# Altium schematic sheet Sheet1.SchDoc
size A; SheetNumber: 1; SheetTotal: 1
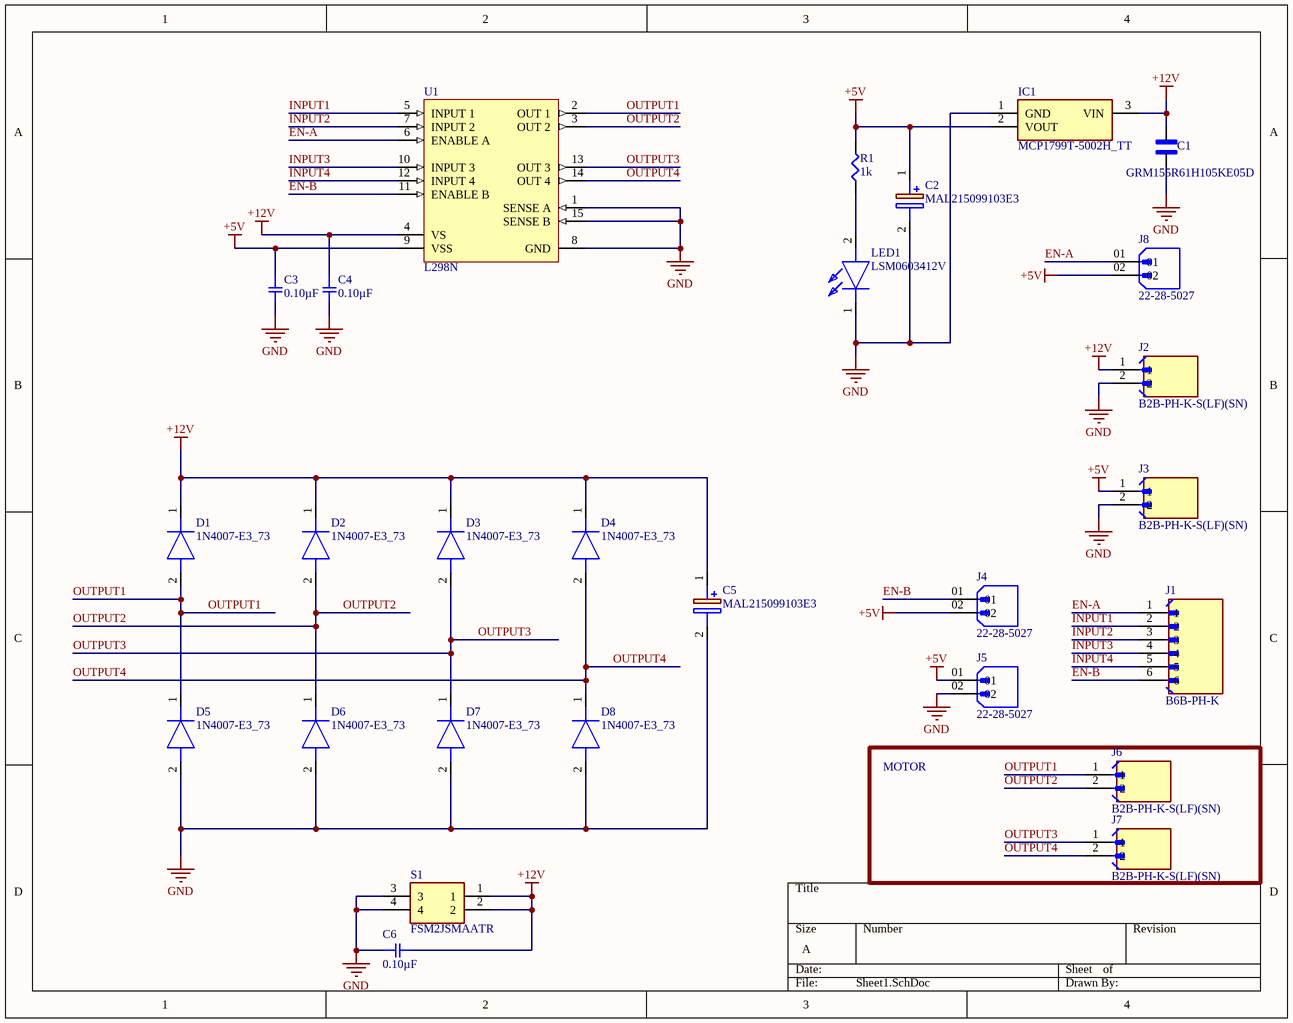
[diagram p0: Sheet1.SchDoc]

## Parts
C1  GRM155R61H105KE05D  [CAPC1005X60N]
C2  MAL215099103E3  [CAPAE1050X1250N]
C3  0.10µF  [SMD-0402C]
C4  0.10µF  [SMD-0402C]
C5  MAL215099103E3  [CAPAE1050X1250N]
C6  0.10µF  [SMD-0402C]
D1  1N4007-E3_73  [PCBComponent_1]
D2  1N4007-E3_73  [PCBComponent_1]
D3  1N4007-E3_73  [PCBComponent_1]
D4  1N4007-E3_73  [PCBComponent_1]
D5  1N4007-E3_73  [PCBComponent_1]
D6  1N4007-E3_73  [PCBComponent_1]
D7  1N4007-E3_73  [PCBComponent_1]
D8  1N4007-E3_73  [PCBComponent_1]
IC1  MCP1799T-5002H_TT  [SOT95P237X112-3N]
J1  B6B-PH-K  [JST_B6B-PH-K]
J2  B2B-PH-K-S(LF)(SN)  [JST_B2B-PH-K-S(LF)(SN)]
J3  B2B-PH-K-S(LF)(SN)  [JST_B2B-PH-K-S(LF)(SN)]
J4  22-28-5027  [MOLEX_22-28-5027]
J5  22-28-5027  [MOLEX_22-28-5027]
J6  B2B-PH-K-S(LF)(SN)  [JST_B2B-PH-K-S(LF)(SN)]
J7  B2B-PH-K-S(LF)(SN)  [JST_B2B-PH-K-S(LF)(SN)]
J8  22-28-5027  [MOLEX_22-28-5027]
LED1  LSM0603412V  [LSM0603412V]
R1  1k  [SMD-0402-RES]
S1  FSM2JSMAATR  [FSM2J_1]
U1  L298N  [STM-FM-15]

## Blocks framed on the sheet
MOTOR: J6 J7

## Nets
+5V: C2.1(+) C3.1 IC1.2(VOUT) J3.1 J4.02 J5.01 J8.02 R1.2 U1.9(VSS)
+12V: C1.2 C4.1 C5.1(+) C6.2 D1.1(K) D2.1(K) D3.1(K) D4.1(K) IC1.3(VIN) J2.1 S1.1 S1.2 U1.4(VS)
GND: C1.1 C2.2(-) C3.2 C4.2 C5.2(-) C6.1 D5.2(A) D6.2(A) D7.2(A) D8.2(A) IC1.1(GND) J2.2 J3.2 J5.02 LED1.1(K) S1.3 S1.4 U1.1(SENSE_A) U1.8(GND) U1.15(SENSE_B)
EN-A: J1.1 J8.01 U1.6(ENABLE_A)
EN-B: J1.6 J4.01 U1.11(ENABLE_B)
INPUT1: J1.2 U1.5(INPUT_1)
INPUT2: J1.3 U1.7(INPUT_2)
INPUT3: J1.4 U1.10(INPUT_3)
INPUT4: J1.5 U1.12(INPUT_4)
OUTPUT1: D1.2(A) D5.1(K) J6.1 U1.2(OUT_1)
OUTPUT2: D2.2(A) D6.1(K) J6.2 U1.3(OUT_2)
OUTPUT3: D3.2(A) D7.1(K) J7.1 U1.13(OUT_3)
OUTPUT4: D4.2(A) D8.1(K) J7.2 U1.14(OUT_4)
NetLED1_2: LED1.2(A) R1.1

## Library data of the parts
C1 = GRM155R61H105KE05D: Capacitor Ceramic Multilayer (MLCC); MF: {'manufacturer': u'Murata'}; Package: None; Price: None; Value: *; MP: GRM155R61H105KE05D; Availability: Unavailable
C2 C5 = MAL215099103E3: Capacitor Polarised; Manufacturer_Name: Vishay; Datasheet Link: https://rs.componentsearchengine.com/Datasheets/1/MAL215099103E3.pdf; Height: 12.5mm; Manufacturer_Part_Number: MAL215099103E3; Mouser Part Number: 594-MAL215099103E3; Mouser Price/Stock: https://www.mouser.co.uk/ProductDetail/Vishay-BC-Components/MAL215099103E3?qs=9y2YoPkPyvaNNuuD%252BAyF3g%3D%3D; Arrow Part Number: MAL215099103E3; Arrow Price/Stock: https://www.arrow.com/en/products/mal215099103e3/vishay?region=nac
C3 C4 C6 = GRM155R61H104KE14D: CAP CER 0.1UF 50V X5R 0402; Manufacturer: Murata Electronics North America; Factory Stock: 0; Unit Price (USD): 0.1; Minimum Quantity: 1; Tolerance: ±10%; Datasheets: http://www.murata.com/~/media/webrenewal/support/library/catalog/products/capacitor/mlcc/c02e.pdf; Image: //media.digikey.com/Renders/Murata%20Renders/ZRB-SERIES-0402.jpg; Digi-Key Part Number: 490-10697-1-ND; Part Number: GRM155R61H104KE14D; Quantity Available: 329219; @ qty: 0; Packaging: Cut Tape (CT); Series: GRM; Part Status: Active; Value: 0.10µF; Voltage: 50V; Temperature Coefficient: X5R; Operating Temperature: -55°C ~ 85°C; Features: -; Ratings: -; Applications: General Purpose; Mounting Type: Surface Mount, MLCC; Package / Case: 0402 (1005 Metric); Size / Dimension: 0.039" L x 0.020" W (1.00mm x 0.50mm); Height - Seated (Max): -; Thickness (Max): 0.022" (0.55mm); Lead Spacing: -; Lead Style: -
D1-D8 = 1N4007-E3_73: Diode; Manufacturer_Name: Vishay; Manufacturer_Part_Number: 1N4007-E3/73; Datasheet Link: https://mouser.componentsearchengine.com/Datasheets/2/1N4007-E3_73.pdf; Mouser Part Number: 625-1N4007-E3/73; Mouser Price/Stock: https://www.mouser.co.uk/ProductDetail/Vishay-General-Semiconductor/1N4007-E3-73?qs=N4vtoAxH%2FSqT3Ng3e4K0Gw%3D%3D; Arrow Part Number: 1N4007-E3/73; Arrow Price/Stock: https://www.arrow.com/en/products/1n4007-e373/vishay?region=europe
IC1 = MCP1799T-5002H_TT: Integrated Circuit; Manufacturer_Name: Microchip; Manufacturer_Part_Number: MCP1799T-5002H/TT; Datasheet Link: https://eu.mouser.com/datasheet/2/268/MCP1799-Data-Sheet-20006248A-1658571.pdf; Height: 1.12mm; Mouser Part Number: 579-CP1799T-5002H/TT; Mouser Price/Stock: https://www.mouser.co.uk/ProductDetail/Microchip-Technology/MCP1799T-5002H-TT?qs=BJlw7L4Cy7%2Fnzou%252BAWMPCQ%3D%3D; Arrow Part Number: MCP1799T-5002H/TT; Arrow Price/Stock: https://www.arrow.com/en/products/mcp1799t-5002htt/microchip-technology?region=nac
J1 = B6B-PH-K: MF: {'manufacturer': u'JST Corporation'}; Package: None; Price: None; Value: *; MP: B6B-PH-K; Availability: Unavailable
J2 J3 J6 J7 = B2B-PH-K-S(LF)(SN): MF: {'manufacturer': u'JST'}; Package: None; Price: None; Value: *; MP: B2B-PH-K-S(LF)(SN); Availability: Unavailable
J4 J5 J8 = 22-28-5027: MF: {'manufacturer': u'Molex'}; Package: None; Price: None; Value: *; MP: 22-28-5027; Availability: Unavailable
LED1 = LSM0603412V: LED; Manufacturer_Name: Visual Communications Company; Datasheet Link: https://vcclite.com/wp-content/uploads/wpallimport/files/files/LSM0603412V.pdf; Height: 0.65mm; Manufacturer_Part_Number: LSM0603412V; Mouser Part Number: 593-LSM0603412V; Mouser Price/Stock: https://www.mouser.co.uk/ProductDetail/VCC/LSM0603412V?qs=%252BEew9%252B0nqrCIKpXilSWEhA%3D%3D; Arrow Part Number: LSM0603412V; Arrow Price/Stock: https://www.arrow.com/en/products/lsm0603412v/visual-communications?region=nac
R1 = ERJ-2GEJ102X: RES SMD 1K OHM 5% 1/10W 0402; Manufacturer: Panasonic Electronic Components; Factory Stock: 0; Unit Price (USD): 0.00350; @ qty: 1500; Minimum Quantity: 1; Power (Watts): 0.1W, 1/10W; Temperature Coefficient: ±200ppm/°C; Part Number: ERJ-2GEJ102X; Datasheets: http://industrial.panasonic.com/www-cgi/jvcr13pz.cgi?E+PZ+3+AOA0001+ERJ2GEJ102X+7+WW; Image: //media.digikey.com/Photos/Panasonic%20Photos/ERJ-PA2-Series.jpg; Digi-Key Part Number: P1.0KJCT-ND; Quantity Available: 1939857; Packaging: Cut Tape (CT); Series: ERJ; Part Status: Active; Value: 1k; Tolerance: ±5%; Composition: Thick Film; Features: Automotive AEC-Q200; Operating Temperature: -55°C ~ 155°C; Package / Case: 0402 (1005 Metric); Supplier Device Package: 0402; Size / Dimension: 0.039" L x 0.020" W (1.00mm x 0.50mm); Height - Seated (Max): 0.016" (0.40mm); Number of Terminations: 2; Failure Rate: -
S1 = FSM2JSMAATR: Switch; Manufacturer_Name: TE Connectivity; Datasheet Link: http://www.te.com/commerce/DocumentDelivery/DDEController?Action=showdoc&DocId=Customer+Drawing%7F2-1437565-7%7FV%7Fpdf%7FEnglish%7FENG_CD_2-1437565-7_V.pdf%7F2-1437565-9; Manufacturer_Part_Number: FSM2JSMAATR; Mouser Part Number: 506-FSM2JSMAATR; Mouser Price/Stock: https://www.mouser.co.uk/ProductDetail/TE-Connectivity-Alcoswitch/FSM2JSMAATR?qs=g%252BEszo6zu8MKdISiZRITCQ%3D%3D; Arrow Part Number: FSM2JSMAATR; Arrow Price/Stock: https://www.arrow.com/en/products/fsm2jsmaatr/te-connectivity?region=nac
U1 = CMP-2000-06526-1: Dual Full-Bridge Driver, 4.8 to 46 V, -40 to 150 degC, 15-Pin FM (MW 15L), RoHS, Tube; Manufacturer: STMicroelectronics; PartNumber: L298; Output Current: 2A; Supply Voltage Max: 7V; Driver Case Style: Multiwatt; Supply Voltage Min: 4.5V; No. of Pins: 15Pins; SVHC: NoSVHC(17-Dec-2015); Output Voltage: 46V; No. of Outputs: 4Outputs; Motor Type: FullBridge; MSL: -; Package Description: 15-Pin Flange Mount, Body 5 x 19.6 mm, Pitch 1.27 mm; Datasheet Version: 01/2000; Package Reference: FM-15; Mounting Technology: ThroughHole; Packaging: Each; Automotive Qualification Standard: -; Product Range: -; Datasheet URL: https://datasheet.ciiva.com/15109/getdatasheetpartid-50682-15109332.pdf; Operating Temperature Max: 130°C; Operating Temperature Min: -25°C; Manufacturer URL: http://www.st.com/